# Altium schematic sheet Main.SchDoc: Main.SchDoc
size A4; Author: Daniel Sinko; DocumentNumber: 1; Revision: A; SheetNumber: 1; SheetTotal: 5
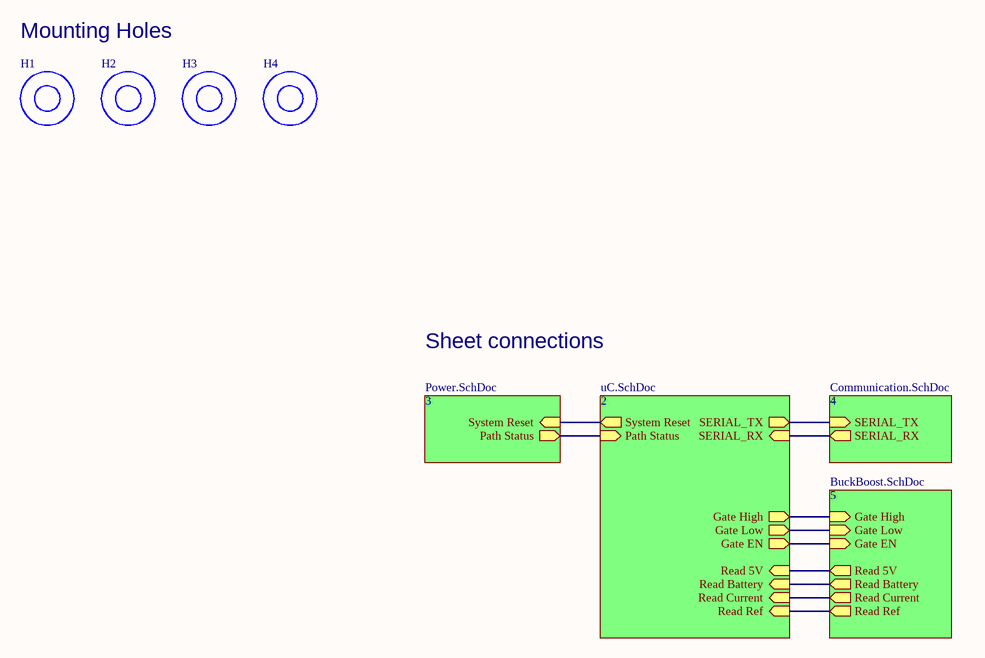
[diagram p0: Main.SchDoc]

## Parts
H1  Mounting_Hole_0  [MOUNTING_HOLE_M3]  (value not drawn)
H2  Mounting_Hole_0  [MOUNTING_HOLE_M3]  (value not drawn)
H3  Mounting_Hole_0  [MOUNTING_HOLE_M3]  (value not drawn)
H4  Mounting_Hole_0  [MOUNTING_HOLE_M3]  (value not drawn)

## Sub-sheets
2 = uC.SchDoc: SERIAL_TX (out), SERIAL_RX (in), System Reset (out), Gate Low (out), Gate EN (out), Read 5V (in), Read Battery (in), Read Current (in), Read Ref (in), Gate High (out), Path Status (in)
3 = Power.SchDoc: System Reset (in), Path Status (out)
4 = Communication.SchDoc: SERIAL_TX (in), SERIAL_RX (out)
5 = BuckBoost.SchDoc: Gate Low (in), Gate EN (in), Read 5V (out), Read Battery (out), Read Current (out), Read Ref (out), Gate High (in)

## Nets
(unnamed): sheet 2/SERIAL_TX, sheet 4/SERIAL_TX
(unnamed): sheet 2/SERIAL_RX, sheet 4/SERIAL_RX
(unnamed): sheet 2/System Reset, sheet 3/System Reset
(unnamed): sheet 2/Gate Low, sheet 5/Gate Low
(unnamed): sheet 2/Gate EN, sheet 5/Gate EN
(unnamed): sheet 2/Read 5V, sheet 5/Read 5V
(unnamed): sheet 2/Read Battery, sheet 5/Read Battery
(unnamed): sheet 2/Read Current, sheet 5/Read Current
(unnamed): sheet 2/Read Ref, sheet 5/Read Ref
(unnamed): sheet 2/Gate High, sheet 5/Gate High
(unnamed): sheet 2/Path Status, sheet 3/Path Status

## Notes on the sheet
- Mounting Holes
- Sheet connections
- Size
- Date
- A4
- Title
- Sheet number
- Author
- Revision

## Library data of the parts
H1-H4 = Mounting_Hole_0: Mounting hole with no connectivity.